# Altium schematic sheet PWM.SchDoc: 8 Bit PWM Comparator
size B; DocumentNumber: 3; Revision: 0; SheetNumber: 3; SheetTotal: 3; Address1: L3, 12a Rodborough Rd; Address2: Frenchs Forest; Address3: NSW; Address4: Australia 2086; Organization: Altium Limited
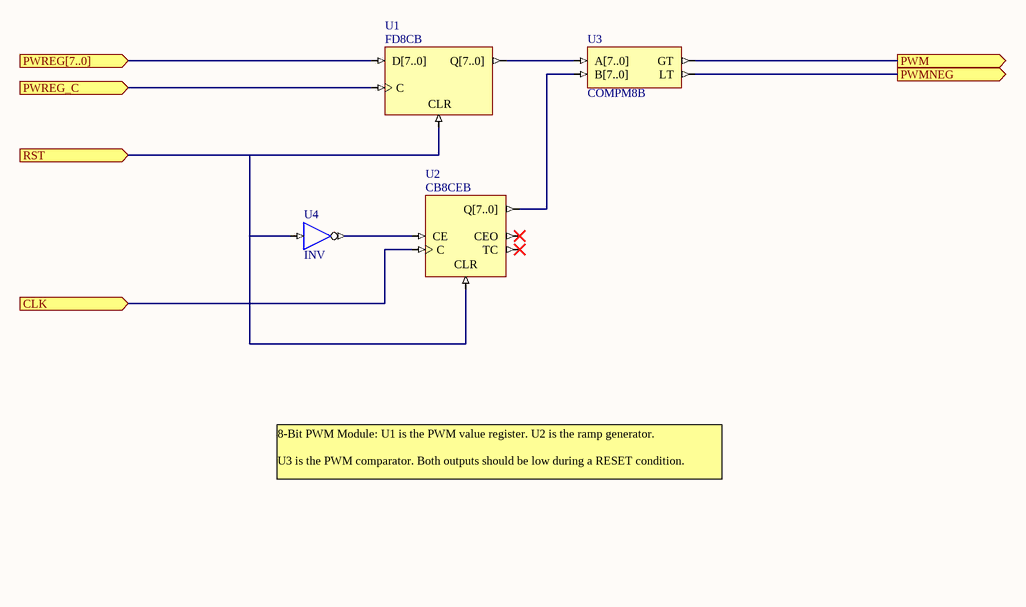
[diagram p0: PWM.SchDoc]

## Parts
U1  FD8CB
U2  CB8CEB
U3  COMPM8B
U4  INV

## Ports
CLK (in), PWM (out), PWMNEG (out), PWREG[7..0] (in), PWREG_C (in), RST (in)

## Nets
CLK: U2.C ; port CLK
PWM: U3.GT ; port PWM
PWMNEG: U3.LT ; port PWMNEG
PWREG[7..0]: U1.D[7..0] ; port PWREG[7..0]
PWREG_C: U1.C ; port PWREG_C
RST: U1.CLR U2.CLR U4.I ; port RST
NetU1_Q[7..0]: U1.Q[7..0] U3.A[7..0]
NetU2_CE: U2.CE U4.O
NetU2_Q[7..0]: U2.Q[7..0] U3.B[7..0]

Not connected (* = marked no-connect by the designer): U2 CEO* TC*

## Notes on the sheet
- 8-Bit PWM Module: U1 is the PWM value register. U2 is the ramp generator.
  U3 is the PWM comparator. Both outputs should be low during a RESET condition.
- Title
- Size:
- Date:
- B
- Number:
- Time:
- Revision:
- Sheet
- of
- File:

## Library data of the parts
U1 = FD8CB: 8-Bit D-Type Flip-Flop with Asynchronous Clear, Bus Version; ArchiveName: GENERIC; VHDLIB_SIM: GENERIC_LIB; SubClass: FD; ClockTrigger: Rising; PortSize: 8; Published: 29-Jan-2004; Publisher: Altium Limited; LastRevisionNo: 1.00.00; HelpURL: CR0118 FPGA Generic Library Guide.pdf#page=171; FunctionalClass: Flip-Flop; Reset: Asynchronous; PortStyle: Bus Version
U2 = CB8CEB: 8-Bit Cascadable Binary Counters with Clock Enable and Asynchronous Clear, Bus Version; ArchiveName: GENERIC; VHDLIB_SIM: GENERIC_LIB; XilinxEquivalent: CB8CE; ClockTrigger: Rising; Enable: High; PortSize: 8; Published: 29-Jan-2004; Publisher: Altium Limited; LastRevisionNo: 1.00.00; HelpURL: CR0118 FPGA Generic Library Guide.pdf#page=127; FunctionalClass: Counter; SubClass: Binary; Reset: Asynchronous; PortType: Bus Version
U3 = COMPM8B: 8-Bit Magnitude Comparator, Bus Version; ArchiveName: GENERIC; VHDLIB_SIM: GENERIC_LIB; XilinxEquivalent: COMPM8; SubClass: COMPM; PortSize: 8; Published: 29-Jan-2004; Publisher: Altium Limited; LastRevisionNo: 1.00.00; HelpURL: CR0118 FPGA Generic Library Guide.pdf#page=152; FunctionalClass: Comparator; PortStyle: Bus Version
U4 = INV: Inverter; ArchiveName: GENERIC; VHDLIB_SIM: GENERIC_LIB; FunctionalClass: Logic Primitive; Published: 29-Jan-2004; Publisher: Altium Limited; XilinxEquivalent: INV; LastRevisionNo: 1.00.00; HelpURL: CR0118 FPGA Generic Library Guide.pdf#page=290; SubClass: INV